# EAGLE schematic R2P_DCM_v2 (EAGLE 6.2)
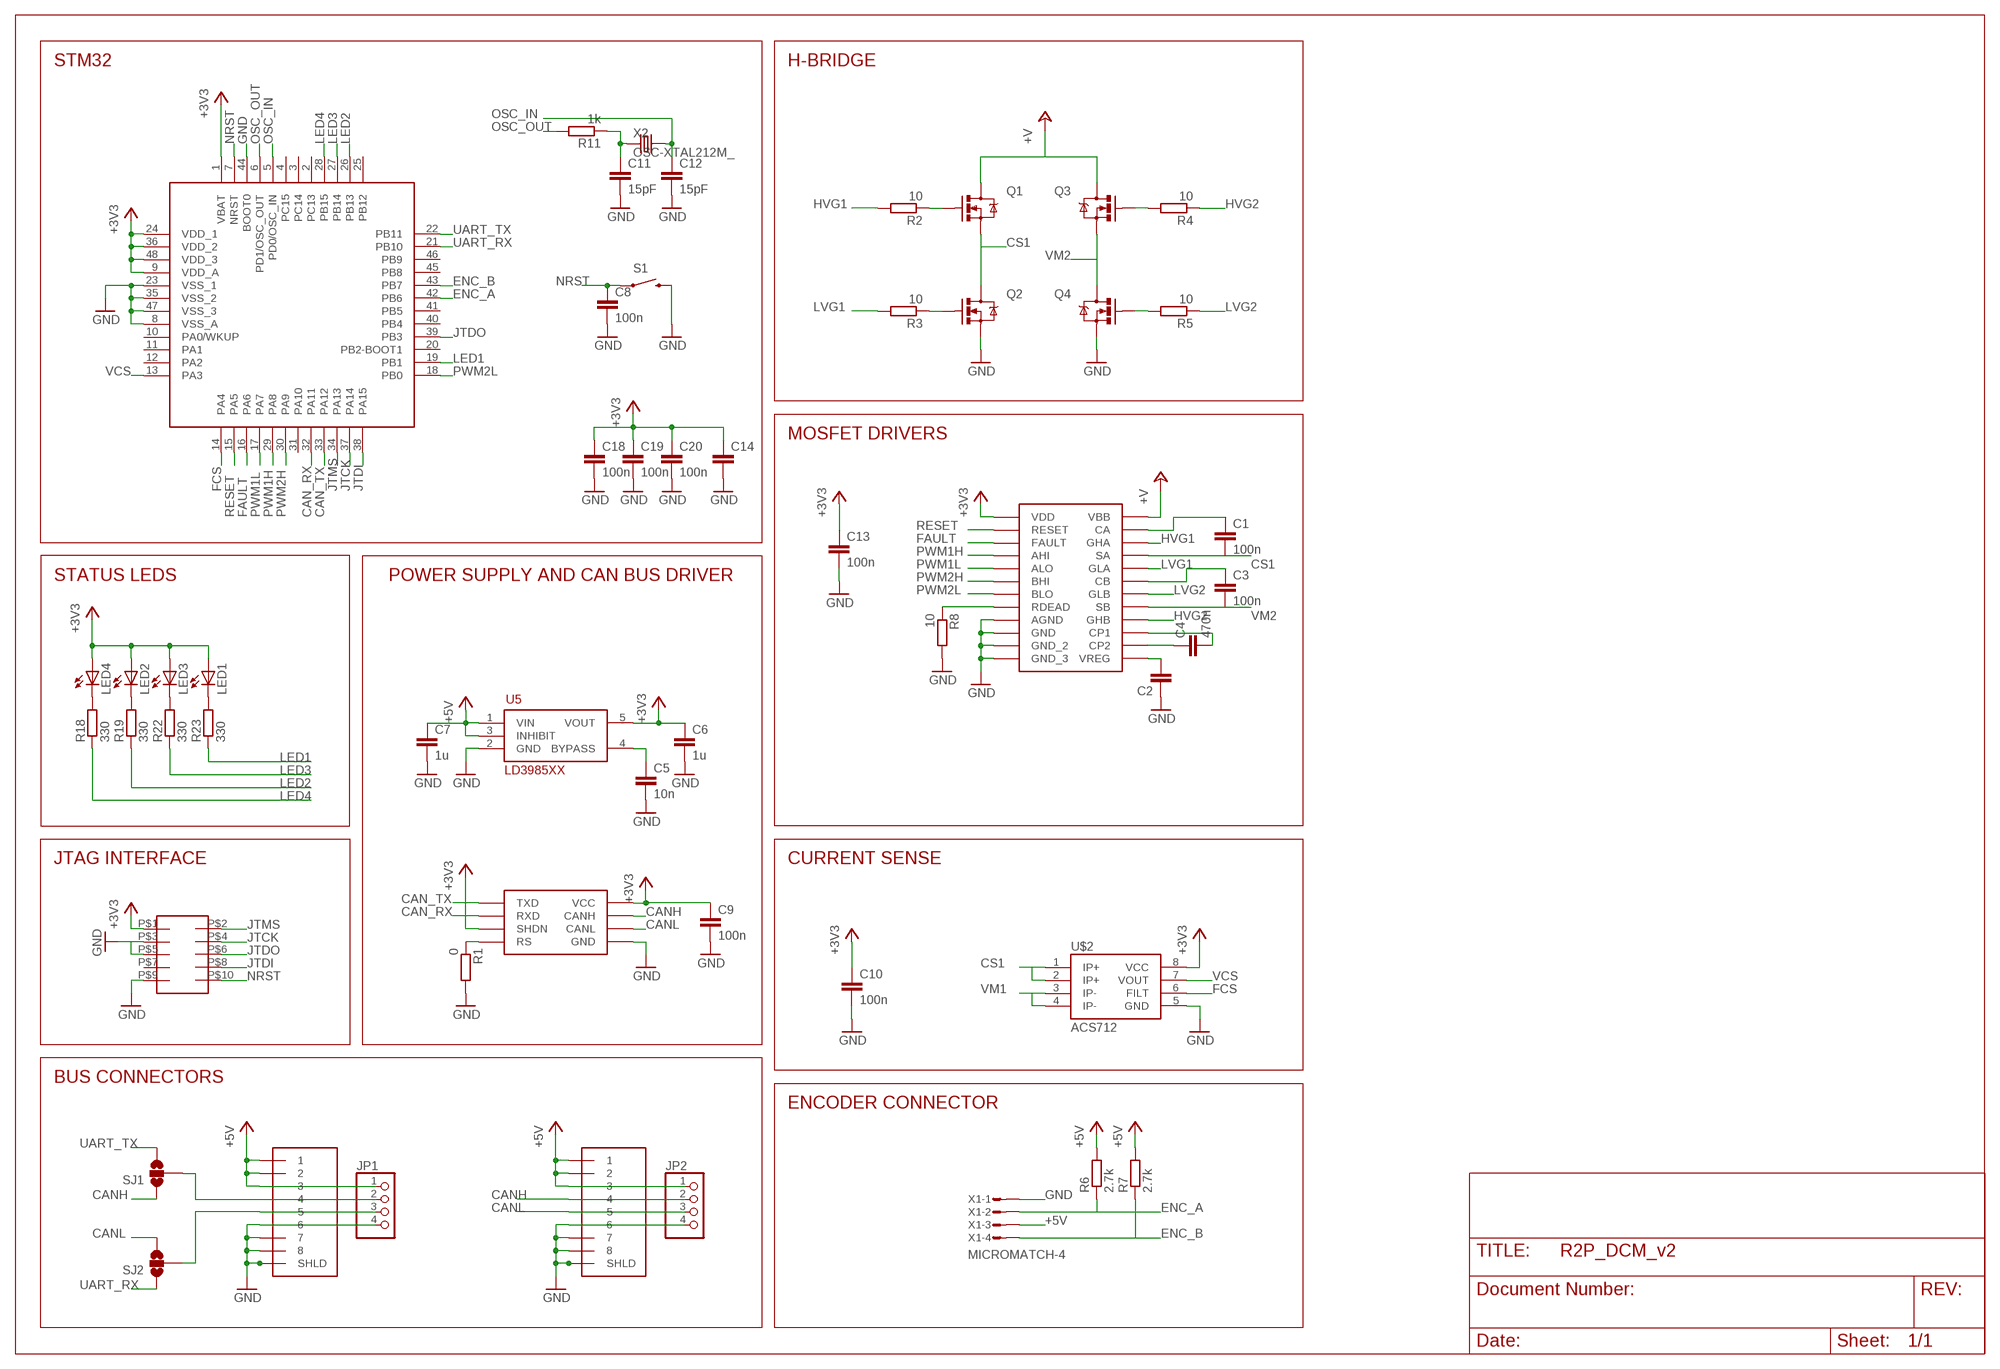
[diagram p0: schematic, sheet 1]

## Parts
1  RJ45-43860  [0438600010]
2  RJ45-43860  [0438600010]
C1  100n  C-EUC0603  [C0603]
C2  C-EUC0805  [C0805]
C3  100n  C-EUC0603  [C0603]
C4  470n  C-EUC0603  [C0603]
C5  10n  C-EUC0603  [C0603]
C6  1u  C-EUC0603  [C0603]
C7  1u  C-EUC0603  [C0603]
C8  100n  C-EUC0603  [C0603]
C9  100n  C-EUC0603  [C0603]
C10  100n  C-EUC0603  [C0603]
C11  15pF  C-EUC0603  [C0603]
C12  15pF  C-EUC0603  [C0603]
C13  100n  C-EUC0603  [C0603]
C14  C-EUC0805  [C0805]
C18  100n  C-EUC0603  [C0603]
C19  100n  C-EUC0603  [C0603]
C20  100n  C-EUC0603  [C0603]
JP1  PINHD-1X4/90  [1X04/90]
JP2  PINHD-1X4/90  [1X04/90]
LED1  LEDCHIPLED_0805  [CHIPLED_0805]
LED2  LEDCHIPLED_0805  [CHIPLED_0805]
LED3  LEDCHIPLED_0805  [CHIPLED_0805]
LED4  LEDCHIPLED_0805  [CHIPLED_0805]
Q1  MOSFET-NCHANNELFDD8580  [DPAK]
Q2  MOSFET-NCHANNELFDD8580  [DPAK]
Q3  MOSFET-NCHANNELFDD8580  [DPAK]
Q4  MOSFET-NCHANNELFDD8580  [DPAK]
R1  0  R-EU_R0603  [R0603]
R2  10  R-EU_R0603  [R0603]
R3  10  R-EU_R0603  [R0603]
R4  10  R-EU_R0603  [R0603]
R5  10  R-EU_R0603  [R0603]
R6  2.7k  R-EU_R0603  [R0603]
R7  2.7k  R-EU_R0603  [R0603]
R8  10  R-EU_R0603  [R0603]
R11  1k  R-EU_R0603  [R0603]
R18  330  R-EU_R0603  [R0603]
R19  330  R-EU_R0603  [R0603]
R22  330  R-EU_R0603  [R0603]
R23  330  R-EU_R0603  [R0603]
S1  SWITCH-MOMENTARY-2-SMD-1101NE  [TACTILE-SWITCH-1101NE]
SJ1  SOLDERJUMPER_2WAYPASTE1&2  [SJ_3_PASTE1&2]
SJ2  SOLDERJUMPER_2WAYPASTE1&2  [SJ_3_PASTE1&2]
SOT1  MAX3051  [SOT23-8L]
U1  STM32F103CX  [LQFP48]
U5  LD3985XX  [SOT23-5L]
U$1  A4940  [TSSOP24]
U$2  ACS712  [SO08]
U$4  FTSH-105  [FTSH-105]
X1  MICROMATCH-4  [MICROMATCH-4]
X2  OSC-XTAL212M_  [4X6]

## Nets
+3V3: C6.1 C9.1 C10.1 C13.1 C14.1 C18.1 C19.1 C20.1 LED1.A LED2.A LED3.A LED4.A SOT1.P$3(VCC) SOT1.P$5(SHDN) U1.1(VBAT) U1.9(VDD_A) U1.24(VDD_1) U1.36(VDD_2) U1.48(VDD_3) U5.5(VOUT) U$1.21(VDD) U$2.8(VCC) U$4.P$1
+5V: 1.P$1 1.P$2 1.P$3 2.P$1 2.P$2 2.P$3 C7.1 JP1.1 JP2.1 R6.2 R7.2 U5.1(VIN) U5.3(INHIBIT) X1.3
+V: Q1.4(D) Q3.4(D) U$1.12(VBB)
CAN_RX: SOT1.P$4(RXD) U1.32(PA11)
CAN_TX: SOT1.P$1(TXD) U1.33(PA12)
CANH: 2.P$4 JP2.2 SJ1.1 SOT1.P$7(CANH)
CANL: 2.P$5 JP2.3 SJ2.3 SOT1.P$6(CANL)
CS1: C1.2 Q1.3(S) Q2.4(D) U$1.10(SA) U$2.1(IP+) U$2.2(IP+)
ENC_A: R6.1 U1.42(PB6) X1.2
ENC_B: R7.1 U1.43(PB7) X1.4
FAULT: U1.16(PA6) U$1.24(FAULT)
FCS: U1.14(PA4) U$2.6(FILT)
GND: 1.P$6 1.P$7 1.P$8 1.P$9(SHLD) 1.P$10 2.P$6 2.P$7 2.P$8 2.P$9(SHLD) 2.P$10 C2.1 C5.2 C6.2 C7.2 C8.2 C9.2 C10.2 C11.2 C12.2 C13.2 C14.2 C18.2 C19.2 C20.2 JP1.4 JP2.4 Q2.3(S) Q4.3(S) R1.2 R8.2 S1.P$2 SOT1.P$2(GND) U1.8(VSS_A) U1.23(VSS_1) U1.35(VSS_2) U1.44(BOOT0) U1.47(VSS_3) U5.2(GND) U$1.2(GND) U$1.15(GND_2) U$1.16(GND_3) U$1.22(AGND) U$1.PAD(GND) U$2.5(GND) U$4.P$3 U$4.P$9 X1.1
HVG1: R2.2 U$1.9(GHA)
HVG2: R4.1 U$1.5(GHB)
JTCK: U1.37(PA14) U$4.P$4
JTDI: U1.38(PA15) U$4.P$8
JTDO: U1.39(PB3) U$4.P$6
JTMS: U1.34(PA13) U$4.P$2
LED1: R23.1 U1.19(PB1)
LED2: R19.1 U1.26(PB13)
LED3: R22.1 U1.27(PB14)
LED4: R18.1 U1.28(PB15)
LVG1: R3.2 U$1.11(GLA)
LVG2: R5.1 U$1.3(GLB)
N$1: U$4.P$5
N$2: R1.1 SOT1.P$8(RS)
N$3: 1.P$4 JP1.2 SJ1.2
N$4: C5.1 U5.4(BYPASS)
N$5: Q1.1(G) R2.1
N$6: Q2.1(G) R3.1
N$7: Q3.1(G) R4.2
N$8: 1.P$5 JP1.3 SJ2.2
N$9: Q4.1(G) R5.2
N$10: C4.1 U$1.13(CP2)
N$11: C4.2 U$1.14(CP1)
N$12: C11.1 R11.1 X2.1(X1)
N$13: C2.2 U$1.7(VREG)
N$15: LED4.C R18.2
N$16: C3.1 U$1.6(CB)
N$17: R8.1 U$1.23(RDEAD)
N$18: LED2.C R19.2
N$20: LED3.C R22.2
N$22: LED1.C R23.2
N$26: C1.1 U$1.8(CA)
NRST: C8.1 S1.P$1 U1.7(NRST) U$4.P$10
OSC_IN: C12.1 U1.5(PD0/OSC_IN) X2.2(X2)
OSC_OUT: R11.2 U1.6(PD1/OSC_OUT)
PWM1H: U1.29(PA8) U$1.20(AHI)
PWM1L: U1.17(PA7) U$1.19(ALO)
PWM2H: U1.30(PA9) U$1.18(BHI)
PWM2L: U1.18(PB0) U$1.17(BLO)
RESET: U1.15(PA5) U$1.1(RESET)
UART_RX: SJ2.1 U1.21(PB10)
UART_TX: SJ1.3 U1.22(PB11)
VCS: U1.13(PA3) U$2.7(VOUT)
VM1: U$2.3(IP-) U$2.4(IP-)
VM2: C3.2 Q3.3(S) Q4.4(D) U$1.4(SB)
Unconnected: U1.2(PC13) U1.3(PC14) U1.4(PC15) U1.10(PA0/WKUP) U1.11(PA1) U1.12(PA2) U1.20(PB2-BOOT1) U1.25(PB12) U1.31(PA10) U1.40(PB4) U1.41(PB5) U1.45(PB8) U1.46(PB9) U$4.P$7

## Notes on the sheet
- STM32 | H-BRIDGE
- MOSFET DRIVERS
- STATUS LEDS | POWER SUPPLY AND CAN BUS DRIVER
- JTAG INTERFACE | CURRENT SENSE
- BUS CONNECTORS
- ENCODER CONNECTOR

## Library data of the parts
1 2 = molex:RJ45-43860
C1-C14 C18-C20 = rcl:C-EU: CAPACITOR, European symbol
JP1 JP2 = pinhead:PINHD-1X4: PIN HEADER
LED1-LED4 = led:LED: LED OSRAM: - CHIPLED LG R971, LG N971, LY N971, LG Q971, LY Q971, LO R971, LY R971 LH N974, LH R974 LS Q976, LO Q976, LY Q976 LO Q996 - Hyper CHIPLED LW Q18S LB Q993, LB Q99A, LB R99A - SideLED LS A670, LO A670, LY A670, LG A670, LP A670 LB A673, LV A673, LT A673, LW A673 LH A674 LY A675 LS A676, LA A676, LO A676, LY A676, LW A676 LS A679, LY A679, LG A679 - Hyper Micro SIDELED® LS Y876, LA Y876, LO Y876, LY Y876 LT Y87S - SmartLED LW L88C, LW L88S LB L89C, LB L89S, LG L890 LS L89K, LO L89K, LY L89K LS L896, LA L896, LO L896, LY L896 - TOPLED LS T670, LO T670, LY T670, LG T670, LP T670 LSG T670, LSP T670, LSY T670, LOP T670, LYG T670 LG T671, LOG T671, LSG T671 LB T673, LV T673, LT T673, LW T673 LH T674 LS T676, LA T676, LO T676, LY T676, LB T676, LH T676, LSB T676, LW T676 LB T67C, LV T67C, LT T67C, LS T67K, LO T67K, LY T67K, LW E67C LS E67B, LA E67B, LO E67B, LY E67B, LB E67C, LV E67C, LT E67C LW T67C LS T679, LY T679, LG T679 LS T770, LO T770, LY T770, LG T770, LP T770 LB T773, LV T773, LT T773, LW T773 LH T774 LS E675, LA E675, LY E675, LS T675 LS T776, LA T776, LO T776, LY T776, LB T776 LHGB T686 LT T68C, LB T68C - Hyper Mini TOPLED® LB M676 - Mini TOPLED Santana® LG M470 LS M47K, LO M47K, LY M47K Source: http://www.osram.convergy.de LUXEON: - LUMILED® LXK2-PW12-R00, LXK2-PW12-S00, LXK2-PW14-U00, LXK2-PW14-V00 LXK2-PM12-R00, LXK2-PM12-S00, LXK2-PM14-U00 LXK2-PE12-Q00, LXK2-PE12-R00, LXK2-PE12-S00, LXK2-PE14-T00, LXK2-PE14-U00 LXK2-PB12-K00, LXK2-PB12-L00, LXK2-PB12-M00, LXK2-PB14-N00, LXK2-PB14-P00, LXK2-PB14-Q00 LXK2-PR12-L00, LXK2-PR12-M00, LXK2-PR14-Q00, LXK2-PR14-R00 LXK2-PD12-Q00, LXK2-PD12-R00, LXK2-PD12-S00 LXK2-PH12-R00, LXK2-PH12-S00 LXK2-PL12-P00, LXK2-PL12-Q00, LXK2-PL12-R00 Source: www.luxeon.com KINGBRIGHT: KA-3528ASYC Source: www.kingbright.com
Q1-Q4 = SparkFun:MOSFET-NCHANNEL
R1-R8 R11 R18 R19 R22 R23 = rcl:R-EU_: RESISTOR, European symbol
S1 = SparkFun:SWITCH-MOMENTARY-2
SJ1 SJ2 = SparkFun:SOLDERJUMPER_2WAY: Solder Jumper 2 way solder jumper
SOT1 = maxim:MAX3051
U1 = st:STM32F103CX
U5 = st:LD3985XX
U$1 = allegro:A4940
U$2 = SparkFun:ACS712
U$4 = samtec:FTSH-105
X1 = apbteam_con-amp-micromatch:MICROMATCH-4: MicroMaTch 4
X2 = dp_devices:OSC-XTAL2